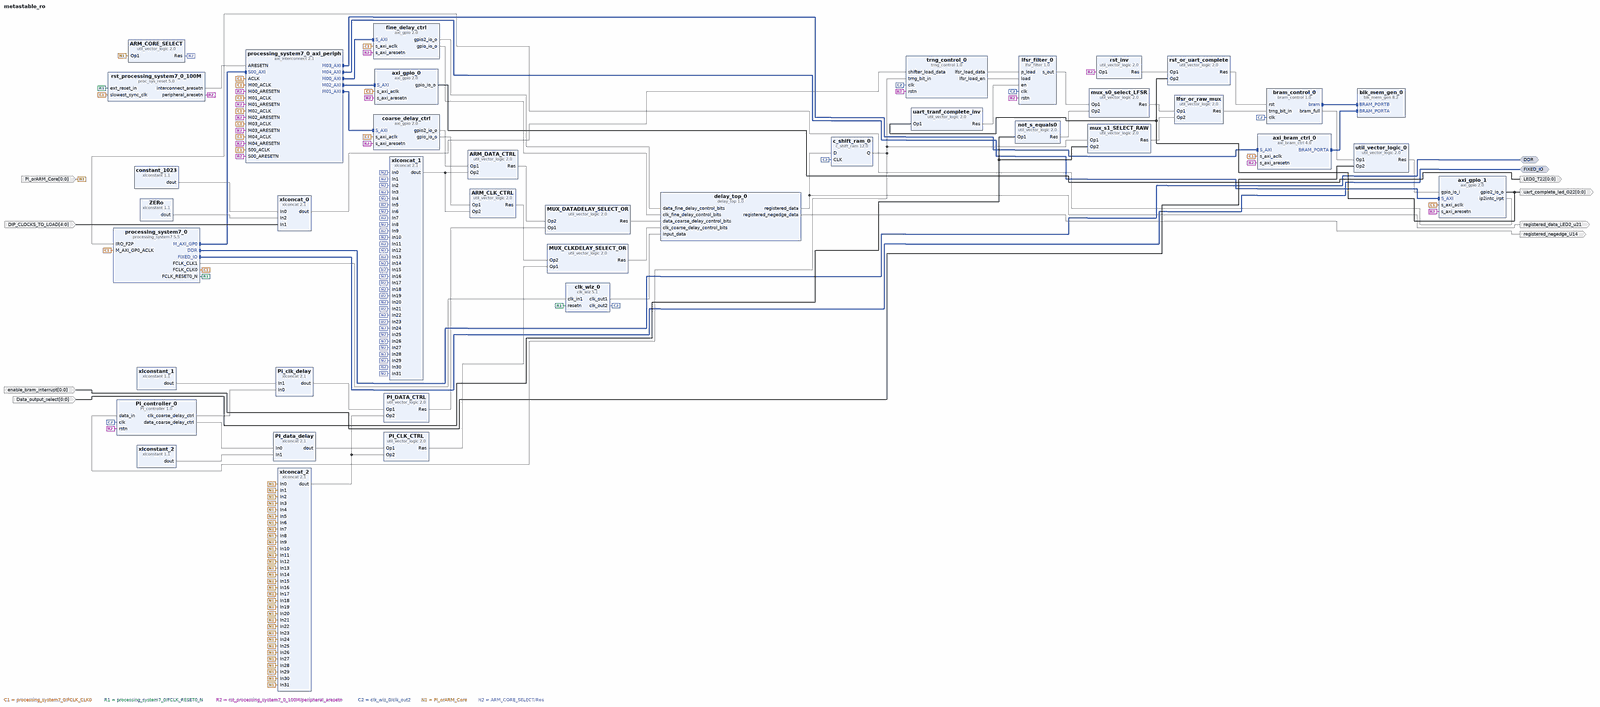
[diagram p0: block diagram of the top level, whole]
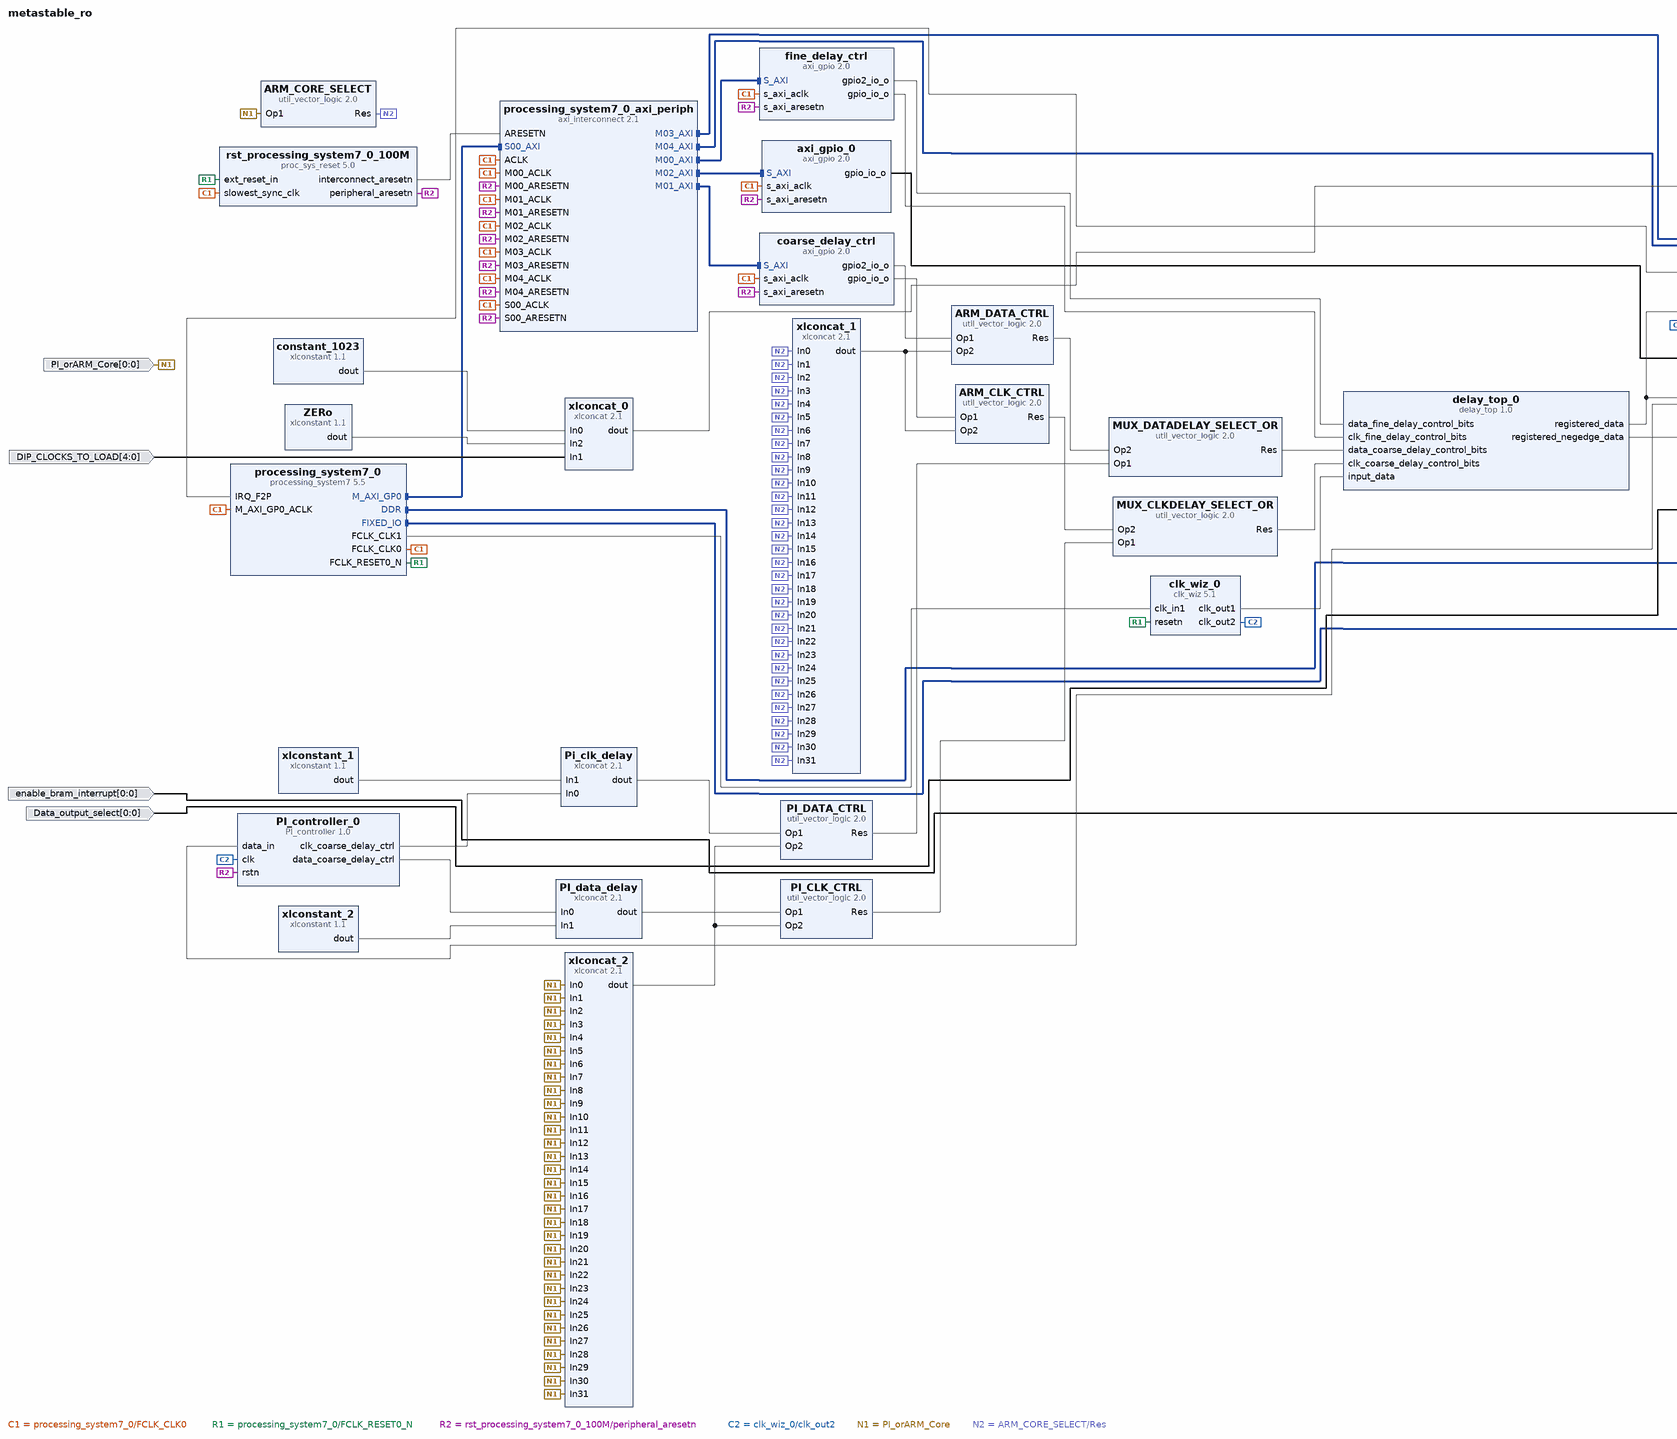
[diagram p1: block diagram of the top level, left part]
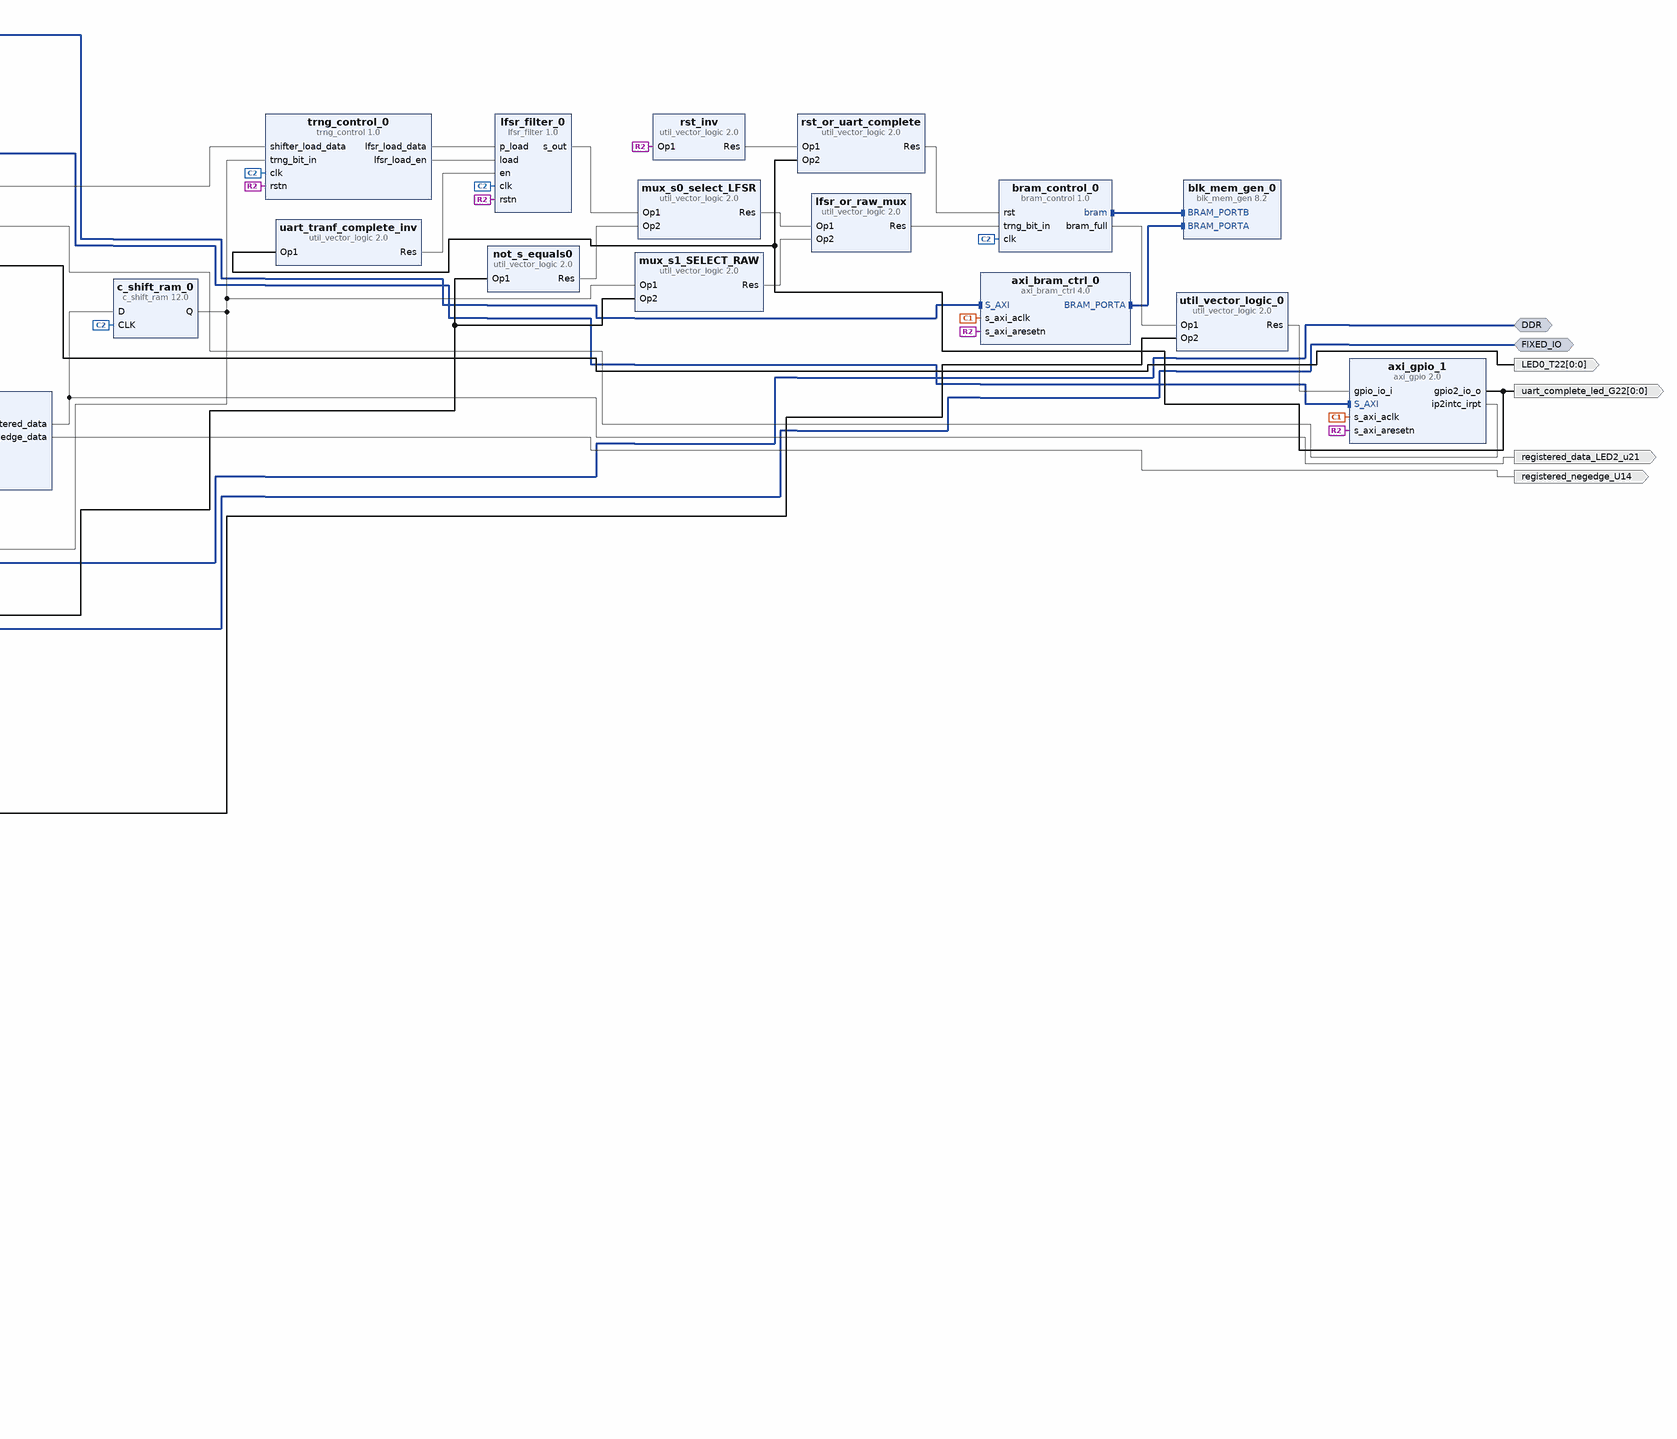
[diagram p2: block diagram of the top level, right part]
# Vivado block design metastable_ro, Vivado 2014.4
create_bd_design metastable_ro

create_bd_intf_port -mode Master -vlnv xilinx.com:interface:ddrx_rtl:1.0 DDR
create_bd_intf_port -mode Master -vlnv xilinx.com:display_processing_system7:fixedio_rtl:1.0 FIXED_IO
create_bd_port -dir O -from 0 -to 0 LED0_T22
create_bd_port -dir O registered_data_LED2_u21
create_bd_port -dir I -from 4 -to 0 DIP_CLOCKS_TO_LOAD
create_bd_port -dir O -from 0 -to 0 uart_complete_led_G22
create_bd_port -dir O registered_negedge_U14
create_bd_port -dir I -from 0 -to 0 enable_bram_interrupt
create_bd_port -dir I -from 0 -to 0 Data_output_select
create_bd_port -dir I -from 0 -to 0 PI_orARM_Core

create_bd_cell -type ip -vlnv xilinx.com:ip:processing_system7:5.5 processing_system7_0
set_property -dict [list \
  CONFIG.PCW_FPGA1_PERIPHERAL_FREQMHZ 50 \
  CONFIG.PCW_USE_FABRIC_INTERRUPT 1 \
  CONFIG.PCW_EN_CLK1_PORT 1 \
  CONFIG.PCW_IRQ_F2P_INTR 1 \
  CONFIG.preset {ZedBoard*} \
] [get_bd_cells processing_system7_0]
create_bd_cell -type ip -vlnv xilinx.com:ip:proc_sys_reset:5.0 rst_processing_system7_0_100M
create_bd_cell -type ip -vlnv xilinx.com:ip:clk_wiz:5.1 clk_wiz_0
set_property -dict [list \
  CONFIG.JITTER_SEL No_Jitter \
  CONFIG.PRIM_IN_FREQ 50 \
  CONFIG.CLKIN1_JITTER_PS 200.0 \
  CONFIG.CLKOUT2_USED true \
  CONFIG.NUM_OUT_CLKS 2 \
  CONFIG.CLKOUT1_REQUESTED_OUT_FREQ 150 \
  CONFIG.CLKOUT2_REQUESTED_OUT_FREQ 100 \
  CONFIG.RESET_TYPE ACTIVE_LOW \
  CONFIG.CLKOUT1_JITTER 159.601 \
  CONFIG.CLKOUT1_PHASE_ERROR 161.614 \
  CONFIG.CLKOUT2_JITTER 175.200 \
  CONFIG.CLKOUT2_PHASE_ERROR 161.614 \
] [get_bd_cells clk_wiz_0]
create_bd_cell -type ip -vlnv xilinx.com:ip:axi_interconnect:2.1 processing_system7_0_axi_periph
set_property -dict {CONFIG.NUM_MI 5} [get_bd_cells processing_system7_0_axi_periph]
create_bd_cell -type ip -vlnv xilinx.com:ip:axi_gpio:2.0 fine_delay_ctrl
set_property -dict [list \
  CONFIG.C_GPIO_WIDTH 32 \
  CONFIG.C_GPIO2_WIDTH 32 \
  CONFIG.C_IS_DUAL 1 \
  CONFIG.C_ALL_OUTPUTS 1 \
  CONFIG.C_ALL_OUTPUTS_2 1 \
] [get_bd_cells fine_delay_ctrl]
create_bd_cell -type ip -vlnv xilinx.com:ip:axi_gpio:2.0 coarse_delay_ctrl
set_property -dict [list \
  CONFIG.C_GPIO_WIDTH 32 \
  CONFIG.C_GPIO2_WIDTH 32 \
  CONFIG.C_IS_DUAL 1 \
  CONFIG.C_ALL_OUTPUTS 1 \
  CONFIG.C_ALL_OUTPUTS_2 1 \
] [get_bd_cells coarse_delay_ctrl]
create_bd_cell -type ip -vlnv xilinx.com:ip:axi_gpio:2.0 axi_gpio_0
set_property -dict {CONFIG.C_GPIO_WIDTH 1 CONFIG.C_ALL_OUTPUTS 1} [get_bd_cells axi_gpio_0]
create_bd_cell -type ip -vlnv user.org:user:trng_control:1.0 trng_control_0
create_bd_cell -type ip -vlnv user.org:user:lfsr_filter:1.0 lfsr_filter_0
create_bd_cell -type ip -vlnv xilinx.com:ip:xlconcat:2.1 xlconcat_0
set_property -dict {CONFIG.NUM_PORTS 3 CONFIG.IN0_WIDTH 10 CONFIG.IN1_WIDTH 5 CONFIG.IN2_WIDTH 1} [get_bd_cells xlconcat_0]
create_bd_cell -type ip -vlnv xilinx.com:ip:xlconstant:1.1 constant_1023
set_property -dict {CONFIG.CONST_WIDTH 10 CONFIG.CONST_VAL 1023} [get_bd_cells constant_1023]
create_bd_cell -type ip -vlnv user.org:user:bram_control:1.0 bram_control_0
set_property -dict {CONFIG.BRAM_DEPTH 2048} [get_bd_cells bram_control_0]
create_bd_cell -type ip -vlnv xilinx.com:ip:blk_mem_gen:8.2 blk_mem_gen_0
set_property -dict [list \
  CONFIG.Memory_Type True_Dual_Port_RAM \
  CONFIG.Enable_B Use_ENB_Pin \
  CONFIG.Use_RSTB_Pin true \
  CONFIG.Port_B_Clock 100 \
  CONFIG.Port_B_Write_Rate 50 \
  CONFIG.Port_B_Enable_Rate 100 \
] [get_bd_cells blk_mem_gen_0]
create_bd_cell -type ip -vlnv xilinx.com:ip:axi_bram_ctrl:4.0 axi_bram_ctrl_0
set_property -dict {CONFIG.SINGLE_PORT_BRAM 1} [get_bd_cells axi_bram_ctrl_0]
create_bd_cell -type ip -vlnv xilinx.com:ip:axi_gpio:2.0 axi_gpio_1
set_property -dict [list \
  CONFIG.C_GPIO_WIDTH 1 \
  CONFIG.C_GPIO2_WIDTH 1 \
  CONFIG.C_IS_DUAL 1 \
  CONFIG.C_ALL_INPUTS 1 \
  CONFIG.C_INTERRUPT_PRESENT 1 \
  CONFIG.C_ALL_OUTPUTS_2 1 \
] [get_bd_cells axi_gpio_1]
create_bd_cell -type ip -vlnv xilinx.com:ip:util_vector_logic:2.0 uart_tranf_complete_inv
set_property -dict {CONFIG.C_SIZE 1 CONFIG.C_OPERATION not} [get_bd_cells uart_tranf_complete_inv]
create_bd_cell -type ip -vlnv Xilinx:user:delay_top:1.0 delay_top_0
set_property -dict {CONFIG.COARSE_DELAY_LENGTH 64} [get_bd_cells delay_top_0]
create_bd_cell -type ip -vlnv xilinx.com:ip:util_vector_logic:2.0 rst_inv
set_property -dict {CONFIG.C_SIZE 1 CONFIG.C_OPERATION not} [get_bd_cells rst_inv]
create_bd_cell -type ip -vlnv xilinx.com:ip:util_vector_logic:2.0 rst_or_uart_complete
set_property -dict {CONFIG.C_SIZE 1 CONFIG.C_OPERATION or} [get_bd_cells rst_or_uart_complete]
create_bd_cell -type ip -vlnv xilinx.com:ip:util_vector_logic:2.0 util_vector_logic_0
set_property -dict {CONFIG.C_SIZE 1} [get_bd_cells util_vector_logic_0]
create_bd_cell -type ip -vlnv xilinx.com:ip:util_vector_logic:2.0 mux_s0_select_LFSR
set_property -dict {CONFIG.C_SIZE 1} [get_bd_cells mux_s0_select_LFSR]
create_bd_cell -type ip -vlnv xilinx.com:ip:util_vector_logic:2.0 mux_s1_SELECT_RAW
set_property -dict {CONFIG.C_SIZE 1} [get_bd_cells mux_s1_SELECT_RAW]
create_bd_cell -type ip -vlnv xilinx.com:ip:util_vector_logic:2.0 not_s_equals0
set_property -dict {CONFIG.C_SIZE 1 CONFIG.C_OPERATION not} [get_bd_cells not_s_equals0]
create_bd_cell -type ip -vlnv xilinx.com:ip:util_vector_logic:2.0 lfsr_or_raw_mux
set_property -dict {CONFIG.C_SIZE 1 CONFIG.C_OPERATION or} [get_bd_cells lfsr_or_raw_mux]
create_bd_cell -type ip -vlnv xilinx.com:ip:xlconstant:1.1 xlconstant_1
set_property -dict {CONFIG.CONST_WIDTH 26 CONFIG.CONST_VAL 0} [get_bd_cells xlconstant_1]
create_bd_cell -type ip -vlnv xilinx.com:ip:xlconcat:2.1 Pi_clk_delay
set_property -dict {CONFIG.IN0_WIDTH 6 CONFIG.IN1_WIDTH 26} [get_bd_cells Pi_clk_delay]
create_bd_cell -type ip -vlnv xilinx.com:ip:xlconstant:1.1 xlconstant_2
set_property -dict {CONFIG.CONST_WIDTH 26 CONFIG.CONST_VAL 0} [get_bd_cells xlconstant_2]
create_bd_cell -type ip -vlnv xilinx.com:ip:xlconcat:2.1 PI_data_delay
set_property -dict {CONFIG.IN0_WIDTH 6 CONFIG.IN1_WIDTH 26} [get_bd_cells PI_data_delay]
create_bd_cell -type ip -vlnv xilinx.com:ip:util_vector_logic:2.0 PI_CLK_CTRL
set_property -dict {CONFIG.C_SIZE 32} [get_bd_cells PI_CLK_CTRL]
create_bd_cell -type ip -vlnv xilinx.com:ip:util_vector_logic:2.0 PI_DATA_CTRL
set_property -dict {CONFIG.C_SIZE 32} [get_bd_cells PI_DATA_CTRL]
create_bd_cell -type ip -vlnv xilinx.com:ip:util_vector_logic:2.0 ARM_DATA_CTRL
set_property -dict {CONFIG.C_SIZE 32} [get_bd_cells ARM_DATA_CTRL]
create_bd_cell -type ip -vlnv xilinx.com:ip:util_vector_logic:2.0 ARM_CLK_CTRL
set_property -dict {CONFIG.C_SIZE 32} [get_bd_cells ARM_CLK_CTRL]
create_bd_cell -type ip -vlnv xilinx.com:ip:util_vector_logic:2.0 ARM_CORE_SELECT
set_property -dict {CONFIG.C_SIZE 1 CONFIG.C_OPERATION not} [get_bd_cells ARM_CORE_SELECT]
create_bd_cell -type ip -vlnv xilinx.com:ip:util_vector_logic:2.0 MUX_CLKDELAY_SELECT_OR
set_property -dict {CONFIG.C_SIZE 32 CONFIG.C_OPERATION or} [get_bd_cells MUX_CLKDELAY_SELECT_OR]
create_bd_cell -type ip -vlnv xilinx.com:ip:util_vector_logic:2.0 MUX_DATADELAY_SELECT_OR
set_property -dict {CONFIG.C_SIZE 32 CONFIG.C_OPERATION or} [get_bd_cells MUX_DATADELAY_SELECT_OR]
create_bd_cell -type ip -vlnv xilinx.com:ip:xlconstant:1.1 ZERo
set_property -dict {CONFIG.CONST_VAL 0} [get_bd_cells ZERo]
create_bd_cell -type ip -vlnv xilinx.com:ip:xlconcat:2.1 xlconcat_1
set_property -dict {CONFIG.NUM_PORTS 32 CONFIG.IN0_WIDTH 1 CONFIG.IN1_WIDTH 1} [get_bd_cells xlconcat_1]
create_bd_cell -type ip -vlnv xilinx.com:ip:xlconcat:2.1 xlconcat_2
set_property -dict {CONFIG.NUM_PORTS 32 CONFIG.IN0_WIDTH 1 CONFIG.IN1_WIDTH 1} [get_bd_cells xlconcat_2]
create_bd_cell -type ip -vlnv user.org:user:PI_controller:1.0 PI_controller_0
create_bd_cell -type ip -vlnv xilinx.com:ip:c_shift_ram:12.0 c_shift_ram_0
set_property -dict {CONFIG.Width 1 CONFIG.Depth 1 CONFIG.DefaultData 0 CONFIG.AsyncInitVal 0} [get_bd_cells c_shift_ram_0]

# ---- connections ----

connect_bd_intf_net [get_bd_intf_pins processing_system7_0/M_AXI_GP0] [get_bd_intf_pins processing_system7_0_axi_periph/S00_AXI]
connect_bd_intf_net [get_bd_intf_pins processing_system7_0_axi_periph/M00_AXI] [get_bd_intf_pins fine_delay_ctrl/S_AXI]
connect_bd_intf_net [get_bd_intf_pins processing_system7_0_axi_periph/M01_AXI] [get_bd_intf_pins coarse_delay_ctrl/S_AXI]
connect_bd_intf_net [get_bd_intf_pins processing_system7_0_axi_periph/M02_AXI] [get_bd_intf_pins axi_gpio_0/S_AXI]
connect_bd_intf_net [get_bd_intf_pins axi_bram_ctrl_0/BRAM_PORTA] [get_bd_intf_pins blk_mem_gen_0/BRAM_PORTA]
connect_bd_intf_net [get_bd_intf_pins bram_control_0/bram] [get_bd_intf_pins blk_mem_gen_0/BRAM_PORTB]
connect_bd_intf_net [get_bd_intf_pins processing_system7_0_axi_periph/M03_AXI] [get_bd_intf_pins axi_bram_ctrl_0/S_AXI]
connect_bd_intf_net [get_bd_intf_pins processing_system7_0_axi_periph/M04_AXI] [get_bd_intf_pins axi_gpio_1/S_AXI]
connect_bd_intf_net [get_bd_intf_ports DDR] [get_bd_intf_pins processing_system7_0/DDR]
connect_bd_intf_net [get_bd_intf_ports FIXED_IO] [get_bd_intf_pins processing_system7_0/FIXED_IO]
connect_bd_net [get_bd_pins processing_system7_0/FCLK_CLK0] \
  [get_bd_pins processing_system7_0/M_AXI_GP0_ACLK] [get_bd_pins rst_processing_system7_0_100M/slowest_sync_clk] \
  [get_bd_pins fine_delay_ctrl/s_axi_aclk] [get_bd_pins coarse_delay_ctrl/s_axi_aclk] [get_bd_pins axi_gpio_0/s_axi_aclk] \
  [get_bd_pins axi_bram_ctrl_0/s_axi_aclk] [get_bd_pins axi_gpio_1/s_axi_aclk] \
  [get_bd_pins processing_system7_0_axi_periph/S00_ACLK] [get_bd_pins processing_system7_0_axi_periph/ACLK] \
  [get_bd_pins processing_system7_0_axi_periph/M00_ACLK] [get_bd_pins processing_system7_0_axi_periph/M01_ACLK] \
  [get_bd_pins processing_system7_0_axi_periph/M02_ACLK] [get_bd_pins processing_system7_0_axi_periph/M03_ACLK] \
  [get_bd_pins processing_system7_0_axi_periph/M04_ACLK]
connect_bd_net [get_bd_pins processing_system7_0/FCLK_RESET0_N] \
  [get_bd_pins rst_processing_system7_0_100M/ext_reset_in] [get_bd_pins clk_wiz_0/resetn]
connect_bd_net [get_bd_pins rst_processing_system7_0_100M/peripheral_aresetn] \
  [get_bd_pins fine_delay_ctrl/s_axi_aresetn] [get_bd_pins coarse_delay_ctrl/s_axi_aresetn] \
  [get_bd_pins axi_gpio_0/s_axi_aresetn] [get_bd_pins axi_bram_ctrl_0/s_axi_aresetn] [get_bd_pins axi_gpio_1/s_axi_aresetn] \
  [get_bd_pins trng_control_0/rstn] [get_bd_pins lfsr_filter_0/rstn] [get_bd_pins rst_inv/Op1] \
  [get_bd_pins processing_system7_0_axi_periph/S00_ARESETN] [get_bd_pins processing_system7_0_axi_periph/M00_ARESETN] \
  [get_bd_pins processing_system7_0_axi_periph/M01_ARESETN] [get_bd_pins processing_system7_0_axi_periph/M02_ARESETN] \
  [get_bd_pins processing_system7_0_axi_periph/M03_ARESETN] [get_bd_pins processing_system7_0_axi_periph/M04_ARESETN] \
  [get_bd_pins PI_controller_0/rstn]
connect_bd_net [get_bd_pins axi_gpio_0/gpio_io_o] [get_bd_ports LED0_T22]
connect_bd_net [get_bd_pins processing_system7_0/FCLK_CLK1] [get_bd_pins clk_wiz_0/clk_in1]
connect_bd_net [get_bd_pins rst_processing_system7_0_100M/interconnect_aresetn] [get_bd_pins processing_system7_0_axi_periph/ARESETN]
connect_bd_net [get_bd_pins delay_top_0/registered_data] [get_bd_ports registered_data_LED2_u21] [get_bd_pins c_shift_ram_0/D]
connect_bd_net [get_bd_pins clk_wiz_0/clk_out2] \
  [get_bd_pins trng_control_0/clk] [get_bd_pins lfsr_filter_0/clk] [get_bd_pins bram_control_0/clk] \
  [get_bd_pins PI_controller_0/clk] [get_bd_pins c_shift_ram_0/CLK]
connect_bd_net [get_bd_pins xlconcat_0/dout] [get_bd_pins trng_control_0/shifter_load_data]
connect_bd_net -net xlconstant_0_dout [get_bd_pins constant_1023/dout] [get_bd_pins xlconcat_0/In0]
connect_bd_net [get_bd_pins trng_control_0/lfsr_load_data] [get_bd_pins lfsr_filter_0/p_load]
connect_bd_net [get_bd_pins trng_control_0/lfsr_load_en] [get_bd_pins lfsr_filter_0/load]
connect_bd_net [get_bd_pins axi_gpio_1/ip2intc_irpt] [get_bd_pins processing_system7_0/IRQ_F2P]
connect_bd_net [get_bd_pins uart_tranf_complete_inv/Res] [get_bd_pins lfsr_filter_0/en]
connect_bd_net [get_bd_pins axi_gpio_1/gpio2_io_o] \
  [get_bd_ports uart_complete_led_G22] [get_bd_pins uart_tranf_complete_inv/Op1] [get_bd_pins rst_or_uart_complete/Op2]
connect_bd_net [get_bd_pins fine_delay_ctrl/gpio2_io_o] [get_bd_pins delay_top_0/data_fine_delay_control_bits]
connect_bd_net [get_bd_pins clk_wiz_0/clk_out1] [get_bd_pins delay_top_0/input_data]
connect_bd_net [get_bd_pins delay_top_0/registered_negedge_data] [get_bd_ports registered_negedge_U14]
connect_bd_net [get_bd_pins rst_inv/Res] [get_bd_pins rst_or_uart_complete/Op1]
connect_bd_net -net util_vector_logic_0_Res [get_bd_pins rst_or_uart_complete/Res] [get_bd_pins bram_control_0/rst]
connect_bd_net [get_bd_pins bram_control_0/bram_full] [get_bd_pins util_vector_logic_0/Op1]
connect_bd_net -net Op2_1 [get_bd_ports enable_bram_interrupt] [get_bd_pins util_vector_logic_0/Op2]
connect_bd_net [get_bd_pins util_vector_logic_0/Res] [get_bd_pins axi_gpio_1/gpio_io_i]
connect_bd_net [get_bd_pins lfsr_filter_0/s_out] [get_bd_pins mux_s0_select_LFSR/Op1]
connect_bd_net -net Op2_2 [get_bd_ports Data_output_select] [get_bd_pins mux_s1_SELECT_RAW/Op2] [get_bd_pins not_s_equals0/Op1]
connect_bd_net -net util_vector_logic_1_Res [get_bd_pins not_s_equals0/Res] [get_bd_pins mux_s0_select_LFSR/Op2]
connect_bd_net -net mux_s0_Res [get_bd_pins mux_s0_select_LFSR/Res] [get_bd_pins lfsr_or_raw_mux/Op1]
connect_bd_net -net mux_s1_Res [get_bd_pins mux_s1_SELECT_RAW/Res] [get_bd_pins lfsr_or_raw_mux/Op2]
connect_bd_net [get_bd_pins lfsr_or_raw_mux/Res] [get_bd_pins bram_control_0/trng_bit_in]
connect_bd_net [get_bd_pins xlconstant_1/dout] [get_bd_pins Pi_clk_delay/In1]
connect_bd_net [get_bd_pins xlconstant_2/dout] [get_bd_pins PI_data_delay/In1]
connect_bd_net [get_bd_pins fine_delay_ctrl/gpio_io_o] [get_bd_pins delay_top_0/clk_fine_delay_control_bits]
connect_bd_net [get_bd_pins PI_data_delay/dout] [get_bd_pins PI_CLK_CTRL/Op1]
connect_bd_net [get_bd_ports PI_orARM_Core] \
  [get_bd_pins ARM_CORE_SELECT/Op1] [get_bd_pins xlconcat_2/In0] [get_bd_pins xlconcat_2/In1] [get_bd_pins xlconcat_2/In2] \
  [get_bd_pins xlconcat_2/In3] [get_bd_pins xlconcat_2/In4] [get_bd_pins xlconcat_2/In6] [get_bd_pins xlconcat_2/In8] \
  [get_bd_pins xlconcat_2/In10] [get_bd_pins xlconcat_2/In20] [get_bd_pins xlconcat_2/In17] [get_bd_pins xlconcat_2/In15] \
  [get_bd_pins xlconcat_2/In12] [get_bd_pins xlconcat_2/In25] [get_bd_pins xlconcat_2/In22] [get_bd_pins xlconcat_2/In28] \
  [get_bd_pins xlconcat_2/In30] [get_bd_pins xlconcat_2/In31] [get_bd_pins xlconcat_2/In29] [get_bd_pins xlconcat_2/In27] \
  [get_bd_pins xlconcat_2/In26] [get_bd_pins xlconcat_2/In23] [get_bd_pins xlconcat_2/In24] [get_bd_pins xlconcat_2/In21] \
  [get_bd_pins xlconcat_2/In19] [get_bd_pins xlconcat_2/In18] [get_bd_pins xlconcat_2/In16] [get_bd_pins xlconcat_2/In14] \
  [get_bd_pins xlconcat_2/In13] [get_bd_pins xlconcat_2/In11] [get_bd_pins xlconcat_2/In9] [get_bd_pins xlconcat_2/In7] \
  [get_bd_pins xlconcat_2/In5]
connect_bd_net [get_bd_pins Pi_clk_delay/dout] [get_bd_pins PI_DATA_CTRL/Op1]
connect_bd_net [get_bd_pins coarse_delay_ctrl/gpio_io_o] [get_bd_pins ARM_CLK_CTRL/Op1]
connect_bd_net [get_bd_pins coarse_delay_ctrl/gpio2_io_o] [get_bd_pins ARM_DATA_CTRL/Op1]
connect_bd_net [get_bd_pins PI_CLK_CTRL/Res] [get_bd_pins MUX_CLKDELAY_SELECT_OR/Op1]
connect_bd_net [get_bd_pins PI_DATA_CTRL/Res] [get_bd_pins MUX_DATADELAY_SELECT_OR/Op1]
connect_bd_net [get_bd_pins ARM_CLK_CTRL/Res] [get_bd_pins MUX_CLKDELAY_SELECT_OR/Op2]
connect_bd_net [get_bd_pins ARM_DATA_CTRL/Res] [get_bd_pins MUX_DATADELAY_SELECT_OR/Op2]
connect_bd_net [get_bd_pins MUX_CLKDELAY_SELECT_OR/Res] [get_bd_pins delay_top_0/clk_coarse_delay_control_bits]
connect_bd_net [get_bd_pins MUX_DATADELAY_SELECT_OR/Res] [get_bd_pins delay_top_0/data_coarse_delay_control_bits]
connect_bd_net [get_bd_ports DIP_CLOCKS_TO_LOAD] [get_bd_pins xlconcat_0/In1]
connect_bd_net [get_bd_pins ZERo/dout] [get_bd_pins xlconcat_0/In2]
connect_bd_net [get_bd_pins ARM_CORE_SELECT/Res] \
  [get_bd_pins xlconcat_1/In0] [get_bd_pins xlconcat_1/In31] [get_bd_pins xlconcat_1/In1] [get_bd_pins xlconcat_1/In2] \
  [get_bd_pins xlconcat_1/In3] [get_bd_pins xlconcat_1/In4] [get_bd_pins xlconcat_1/In5] [get_bd_pins xlconcat_1/In6] \
  [get_bd_pins xlconcat_1/In7] [get_bd_pins xlconcat_1/In8] [get_bd_pins xlconcat_1/In9] [get_bd_pins xlconcat_1/In11] \
  [get_bd_pins xlconcat_1/In12] [get_bd_pins xlconcat_1/In13] [get_bd_pins xlconcat_1/In16] [get_bd_pins xlconcat_1/In17] \
  [get_bd_pins xlconcat_1/In20] [get_bd_pins xlconcat_1/In22] [get_bd_pins xlconcat_1/In23] [get_bd_pins xlconcat_1/In26] \
  [get_bd_pins xlconcat_1/In29] [get_bd_pins xlconcat_1/In30] [get_bd_pins xlconcat_1/In28] [get_bd_pins xlconcat_1/In27] \
  [get_bd_pins xlconcat_1/In25] [get_bd_pins xlconcat_1/In24] [get_bd_pins xlconcat_1/In21] [get_bd_pins xlconcat_1/In19] \
  [get_bd_pins xlconcat_1/In18] [get_bd_pins xlconcat_1/In15] [get_bd_pins xlconcat_1/In14] [get_bd_pins xlconcat_1/In10]
connect_bd_net [get_bd_pins xlconcat_1/dout] [get_bd_pins ARM_CLK_CTRL/Op2] [get_bd_pins ARM_DATA_CTRL/Op2]
connect_bd_net [get_bd_pins xlconcat_2/dout] [get_bd_pins PI_CLK_CTRL/Op2] [get_bd_pins PI_DATA_CTRL/Op2]
connect_bd_net [get_bd_pins PI_controller_0/clk_coarse_delay_ctrl] [get_bd_pins Pi_clk_delay/In0]
connect_bd_net [get_bd_pins PI_controller_0/data_coarse_delay_ctrl] [get_bd_pins PI_data_delay/In0]
connect_bd_net [get_bd_pins c_shift_ram_0/Q] \
  [get_bd_pins PI_controller_0/data_in] [get_bd_pins mux_s1_SELECT_RAW/Op1] [get_bd_pins trng_control_0/trng_bit_in]

# ---- address map ----
assign_bd_address -offset 0x40000000 -range 8K -target_address_space [get_bd_addr_spaces processing_system7_0/Data] [get_bd_addr_segs axi_bram_ctrl_0/S_AXI/Mem0]
assign_bd_address -offset 0x41200000 -range 64K -target_address_space [get_bd_addr_spaces processing_system7_0/Data] [get_bd_addr_segs fine_delay_ctrl/S_AXI/Reg]
assign_bd_address -offset 0x41210000 -range 64K -target_address_space [get_bd_addr_spaces processing_system7_0/Data] [get_bd_addr_segs coarse_delay_ctrl/S_AXI/Reg]
assign_bd_address -offset 0x41220000 -range 64K -target_address_space [get_bd_addr_spaces processing_system7_0/Data] [get_bd_addr_segs axi_gpio_0/S_AXI/Reg]
assign_bd_address -offset 0x41230000 -range 64K -target_address_space [get_bd_addr_spaces processing_system7_0/Data] [get_bd_addr_segs axi_gpio_1/S_AXI/Reg]

validate_bd_design
save_bd_design
